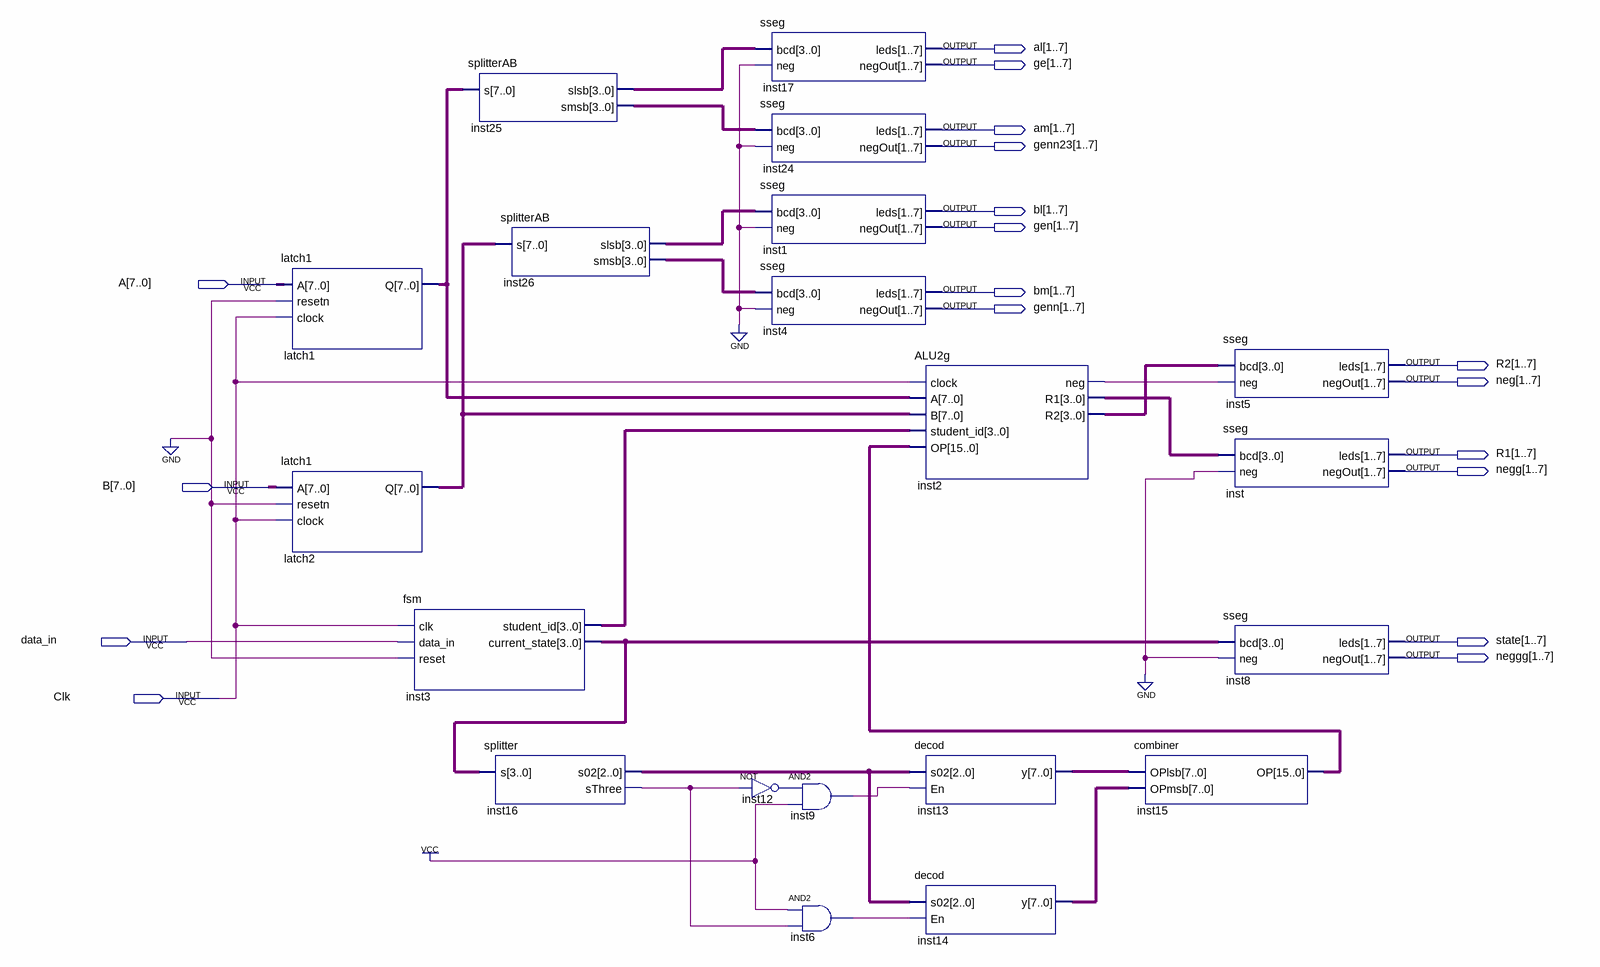
[diagram p0: schematic sheet]
// Quartus schematic Lab62g.bdf as structural Verilog: 20 symbols, 18 pins
module Lab62g (
  input  [7:0] A,
  input  [7:0] B,
  input  data_in,
  input  Clk,
  output [1:7] al,
  output [1:7] ge,
  output [1:7] am,
  output [1:7] genn23,
  output [1:7] bl,
  output [1:7] gen,
  output [1:7] bm,
  output [1:7] genn,
  output [1:7] R2,
  output [1:7] neg,
  output [1:7] R1,
  output [1:7] negg,
  output [1:7] state,
  output [1:7] neggg
);

  wire inst2_neg, inst6_out, inst9_out, inst12_out, inst16_sthree;
  wire [2:0] inst16_s02;
  wire [3:0] inst2_r1, inst2_r2, inst3_current_state, inst3_student_id, inst25_slsb, inst25_smsb,
       inst26_slsb, inst26_smsb;
  wire [7:0] inst13_y, inst14_y, latch1_q, latch2_q;
  wire [15:0] inst15_op;

  latch1 latch1 (.A(A), .resetn(1'b0), .clock(Clk), .Q(latch1_q));
  latch1 latch2 (.A(B), .resetn(1'b0), .clock(Clk), .Q(latch2_q));
  fsm inst3 (
    .clk(Clk), .data_in(data_in), .reset(1'b0), .student_id(inst3_student_id),
    .current_state(inst3_current_state));
  splitterAB inst25 (.s(latch1_q), .slsb(inst25_slsb), .smsb(inst25_smsb));
  splitter inst16 (.s(inst3_current_state), .s02(inst16_s02), .sThree(inst16_sthree));
  splitterAB inst26 (.s(latch2_q), .slsb(inst26_slsb), .smsb(inst26_smsb));
  not inst12 (inst12_out, inst16_sthree);
  sseg inst17 (.bcd(inst25_slsb), .neg(1'b0), .leds(al), .negOut(ge));
  sseg inst24 (.bcd(inst25_smsb), .neg(1'b0), .leds(am), .negOut(genn23));
  sseg inst1 (.bcd(inst26_slsb), .neg(1'b0), .leds(bl), .negOut(gen));
  sseg inst4 (.bcd(inst26_smsb), .neg(1'b0), .leds(bm), .negOut(genn));
  and inst9 (inst9_out, inst12_out, 1'b1);
  and inst6 (inst6_out, 1'b1, inst16_sthree);
  ALU2g inst2 (
    .clock(Clk), .A(latch1_q), .B(latch2_q), .student_id(inst3_student_id), .OP(inst15_op), .neg(inst2_neg),
    .R1(inst2_r1), .R2(inst2_r2));
  decod inst13 (.s02(inst16_s02), .En(inst9_out), .y(inst13_y));
  decod inst14 (.s02(inst16_s02), .En(inst6_out), .y(inst14_y));
  combiner inst15 (.OPlsb(inst13_y), .OPmsb(inst14_y), .OP(inst15_op));
  sseg inst5 (.bcd(inst2_r2), .neg(inst2_neg), .leds(R2), .negOut(neg));
  sseg inst (.bcd(inst2_r1), .neg(1'b0), .leds(R1), .negOut(negg));
  sseg inst8 (.bcd(inst3_current_state), .neg(1'b0), .leds(state), .negOut(neggg));
endmodule
